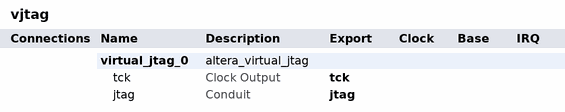
[diagram p0: system contents]
# Platform Designer (Qsys) system vjtag, Cyclone V 5CSEMA5F31C6
# Parameters at their usual value, and those the tool derives, are not listed.
package require -exact qsys 18.1
create_system vjtag
set_project_property DEVICE_FAMILY {Cyclone V}
set_project_property DEVICE 5CSEMA5F31C6

add_instance virtual_jtag_0 altera_virtual_jtag 18.1
set_instance_property virtual_jtag_0 AUTO_EXPORT true
set_instance_parameter_value virtual_jtag_0 CREATE_PRIMITIVE_JTAG_STATE_SIGNAL_PORTS false
set_instance_parameter_value virtual_jtag_0 device_family {Cyclone V}
set_instance_parameter_value virtual_jtag_0 gui_use_auto_index true
set_instance_parameter_value virtual_jtag_0 sld_instance_index 0
set_instance_parameter_value virtual_jtag_0 sld_ir_width 2

# exported interfaces
add_interface jtag conduit end
set_interface_property jtag EXPORT_OF virtual_jtag_0.jtag
add_interface tck clock source
set_interface_property tck EXPORT_OF virtual_jtag_0.tck

set_interconnect_requirement {$system} qsys_mm.clockCrossingAdapter HANDSHAKE
set_interconnect_requirement {$system} qsys_mm.enableEccProtection FALSE
set_interconnect_requirement {$system} qsys_mm.insertDefaultSlave FALSE
set_interconnect_requirement {$system} qsys_mm.maxAdditionalLatency 1

save_system vjtag.qsys
